# Altium schematic sheet ESP32.SchDoc
size A4; SheetNumber: 7; SheetTotal: 8
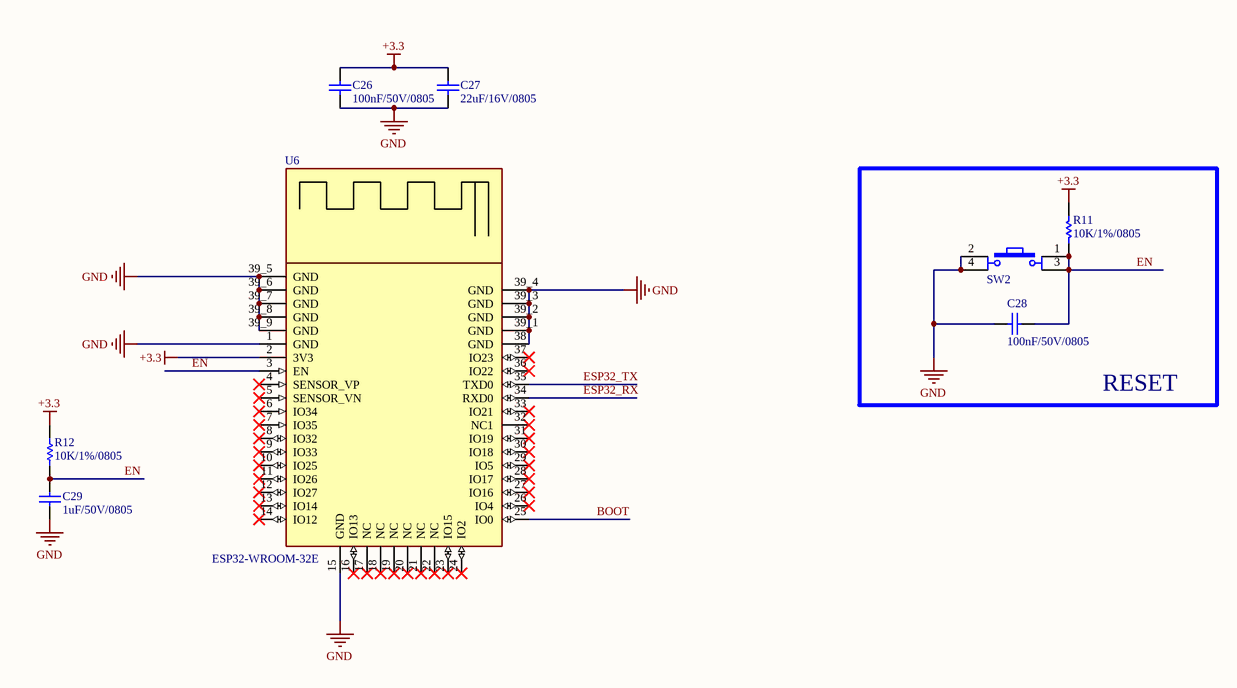
[diagram p0: ESP32.SchDoc]

## Parts
C26  value 100nF/50V/0805  [CAP-SM-0805]  (hidden comment: Cap Non-Pol SMD)
C27  value 22uF/16V/0805  [CAP-SM-0805]  (hidden comment: Cap Non-Pol SMD)
C28  value 100nF/50V/0805  [CAP-SM-0805]  (hidden comment: Cap Non-Pol SMD)
C29  value 1uF/50V/0805  [CAP-SM-0805]  (hidden comment: Cap Non-Pol SMD)
R11  value 10K/1%/0805  [RES-SM-0805]  (hidden comment: RESISTOR SMD)
R12  value 10K/1%/0805  [RES-SM-0805]  (hidden comment: RESISTOR SMD)
SW2  SW  [Tact SW 4 pin]  (value not drawn)
U6  ESP32-WROOM-32E  [ESP32-WROOM-32E]

## Blocks framed on the sheet
RESET: C28 R11 SW2

## Nets
+3.3: C26.1 C27.1 R11.2 R12.2 U6.2(3V3)
GND: C26.2 C27.2 C28.2 C29.1 SW2.2 SW2.4 U6.1(GND) U6.15(GND) U6.38(GND) U6.39_1(GND) U6.39_2(GND) U6.39_3(GND) U6.39_4(GND) U6.39_5(GND) U6.39_6(GND) U6.39_7(GND) U6.39_8(GND) U6.39_9(GND)
BOOT: U6.25(IO0)
EN: C28.1 C29.2 R11.1 R12.1 SW2.1 SW2.3 U6.3(EN)
ESP32_RX: U6.34(RXD0)
ESP32_TX: U6.35(TXD0)

Not connected (* = marked no-connect by the designer): U6 4(SENSOR_VP)* 5(SENSOR_VN)* 6(IO34)* 7(IO35)* 8(IO32)* 9(IO33)* 10(IO25)* 11(IO26)* 12(IO27)* 13(IO14)* 14(IO12)* 16(IO13)* 17(NC)* 18(NC)* 19(NC)* 20(NC)* 21(NC)* 22(NC)* 23(IO15)* 24(IO2)* 26(IO4)* 27(IO16)* 28(IO17)* 29(IO5)* 30(IO18)* 31(IO19)* 32(NC1)* 33(IO21)* 36(IO22)* 37(IO23)*

## Library data of the parts
C26-C29 = Cap Non-Pol SMD: Capacitor
R11 R12 = RESISTOR SMD: Resistor
SW2 = Tact SW - 4Pin: Switch button 4 pin; Value: Button chip 4 pin